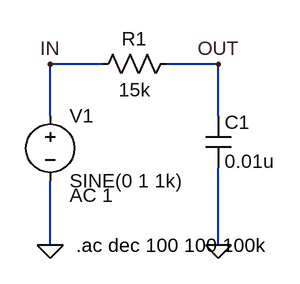
[diagram p0: schematic 2-1-1_RC_LPF.asc]
2-1-1_RC_LPF.asc, the LTspice schematic file:
Version 4.1
SHEET 1 880 680
WIRE 160 48 96 48
WIRE 304 48 240 48
WIRE 96 112 96 48
WIRE 304 112 304 48
WIRE 96 272 96 192
WIRE 304 272 304 176
FLAG 96 272 0
FLAG 304 272 0
FLAG 304 48 OUT
FLAG 96 48 IN
SYMBOL voltage 96 96 R0
WINDOW 123 24 114 Left 2
WINDOW 39 0 0 Left 0
SYMATTR InstName V1
SYMATTR Value SINE(0 1 1k)
SYMATTR Value2 AC 1
SYMBOL res 256 32 R90
WINDOW 0 0 56 VBottom 2
WINDOW 3 32 56 VTop 2
SYMATTR InstName R1
SYMATTR Value 15k
SYMBOL cap 288 112 R0
SYMATTR InstName C1
SYMATTR Value 0.01u
TEXT 128 272 Left 2 !.ac dec 100 100 100k

The netlist it stands for:
* 2-1-1_RC_LPF.asc
V1 IN 0 SINE(0 1 1k) AC 1
R1 OUT IN 15k
C1 OUT 0 0.01u
.ac dec 100 100 100k
.backanno
.end